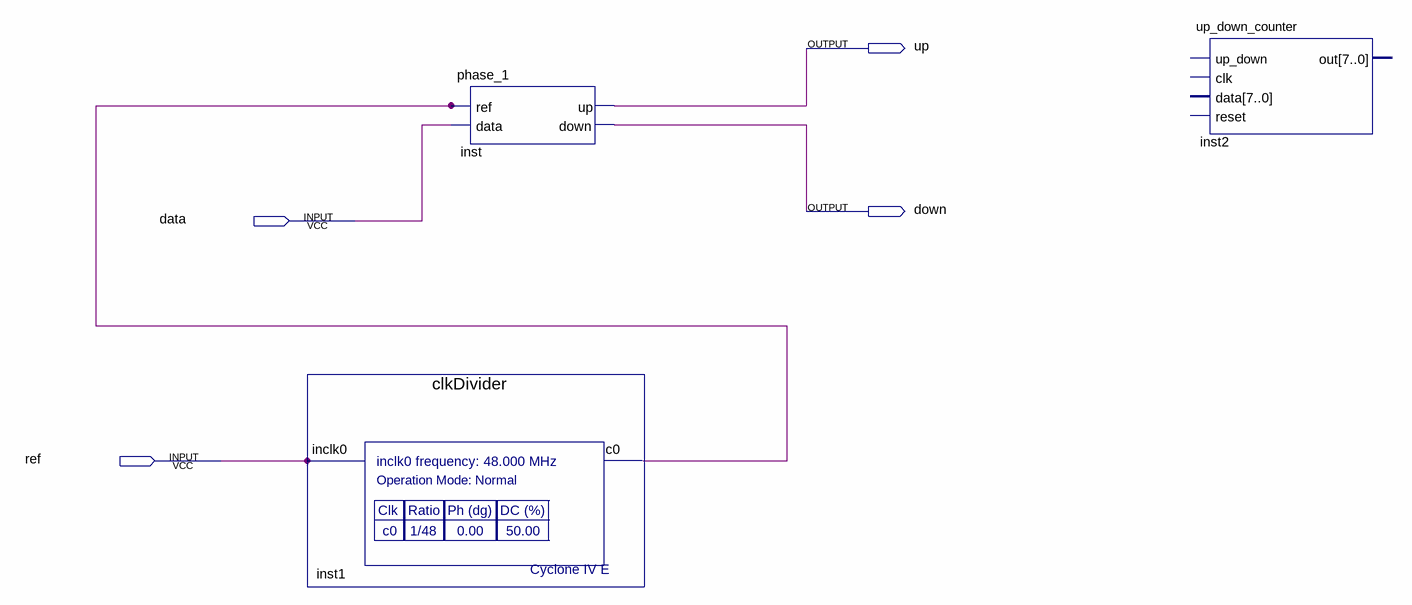
[diagram p0: schematic sheet]
// Quartus schematic phase_1_top.bdf as structural Verilog: 3 symbols, 4 pins
module phase_1_top (
  input  data,
  input  \ref ,
  output up,
  output down
);

  wire inst1_c0;

  clkDivider inst1 (.inclk0(\ref ), .c0(inst1_c0));
  phase_1 inst (.\ref (inst1_c0), .data(data), .up(up), .down(down));
  up_down_counter inst2 ();  // open: up_down, clk, data, reset, out
endmodule
